# Altium schematic sheet EPS_MPPT_X_OR_MPB.SchDoc: MPPT-X / MPB ORing
size A4; SheetNumber: 12; SheetTotal: 51
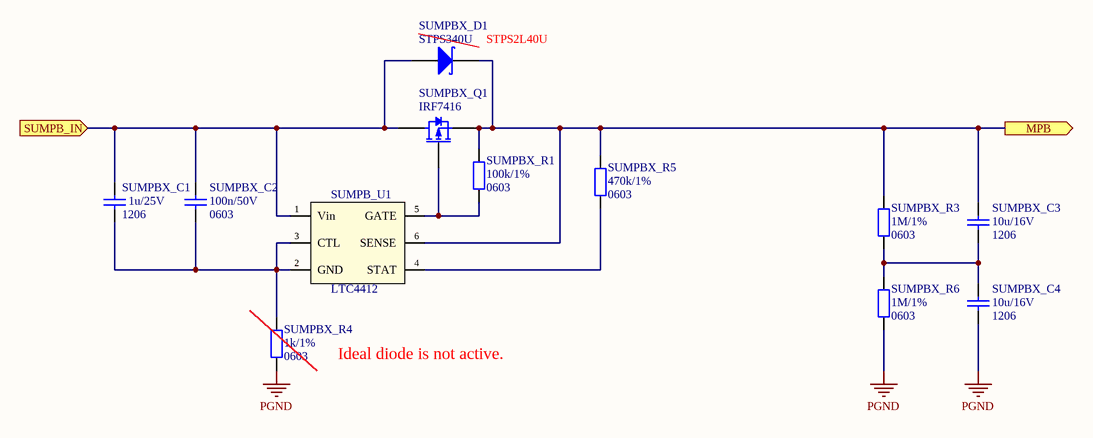
[diagram p0: EPS_MPPT_X_OR_MPB.SchDoc]

## Parts
SUMPB_U1  LTC4412  [SOT23-6]
SUMPBX_C1  Package: 1206  [SMD_Capacitor_1206]  (hidden comment: 1u/25V)
SUMPBX_C2  Package: 0603  [SMD_Capacitor_0603]  (hidden comment: 100n/50V)
SUMPBX_C3  Packge: 1206  [SMD_Capacitor_1206]  (hidden comment: 10u/16V)
SUMPBX_C4  Packge: 1206  [SMD_Capacitor_1206]  (hidden comment: 10u/16V)
SUMPBX_D1  STPS340U  [DO-214AA]
SUMPBX_Q1  IRF7416  [SOIC-8-N_SSSGDDDD]
SUMPBX_R1  Package: 0603  [SMD_Resistor_0603]  (hidden comment: 100k/1%)
SUMPBX_R3  Package: 0603  [SMD_Resistor_0603]  (hidden comment: 1M/1%)
SUMPBX_R4  Package: 0603  [SMD_Resistor_0603]  (hidden comment: 1k/1%)
SUMPBX_R5  Package: 0603  [SMD_Resistor_0603]  (hidden comment: 470k/1%)
SUMPBX_R6  Package: 0603  [SMD_Resistor_0603]  (hidden comment: 1M/1%)

## Ports
MPB (out), SUMPB_IN (in)

## Nets
PGND: SUMPBX_C4.2 SUMPBX_R4.2 SUMPBX_R6.2
MPB: SUMPB_U1.6(SENSE) SUMPBX_C3.1 SUMPBX_D1.K SUMPBX_Q1.S SUMPBX_R1.1 SUMPBX_R3.1 SUMPBX_R5.1 ; port MPB
SUMPB_IN: SUMPB_U1.1(Vin) SUMPBX_C1.1 SUMPBX_C2.1 SUMPBX_D1.A SUMPBX_Q1.D ; port SUMPB_IN
NetSUMPB_U1_2: SUMPB_U1.2(GND) SUMPB_U1.3(CTL) SUMPBX_C1.2 SUMPBX_C2.2 SUMPBX_R4.1
NetSUMPB_U1_4: SUMPB_U1.4(STAT) SUMPBX_R5.2
NetSUMPB_U1_5: SUMPB_U1.5(GATE) SUMPBX_Q1.G SUMPBX_R1.2
NetSUMPBX_C3_2: SUMPBX_C3.2 SUMPBX_C4.1 SUMPBX_R3.2 SUMPBX_R6.1

## Notes on the sheet
- (near SUMPBX_D1) STPS2L40U
- Ideal diode is not active.
- Title:
- Project:
- Author:
- Model:
- Document Number:
- Checked by:
- Rev:
- Date:
- Approved by:
- Sheet:
- of
- File name:

## Library data of the parts
SUMPB_U1 = LTC4412: Ideal Diode, Low Loss PowerPath Controller.; Manufacturer: Linear Technology; Value: LTC4412
SUMPBX_C1 = Cer_C1206T105K3RALTU: Ceramic Cap Kemet COTS 1u/25V X7R 1206; ManufacturerPartNumber: C1206T105K3RALTU; Manufacturer: Kemet; Value: 1u/25V
SUMPBX_C2 = Cer_GCJ188R71H104KA12D: Ceramic Cap Murata Automotive 100n/50V X7R 0603; Manufacturer: Murata; ManufacturerPartNumber: GCJ188R71H104KA12D; Value: 100n/50V
SUMPBX_C3 SUMPBX_C4 = Cer_C1206T106K4RACTU: Ceramic Cap Kemet COTS 10u/16V X7R 1206; ManufacturerPartNumber: C1206T106K4RACTU; Manufacturer: Kemet; Value: 10u/16V
SUMPBX_D1 = STPS340x: 3A/40V Power Schottky Rectifier.; Manufacturer: STMicroelectronics; Value: STPS340U
SUMPBX_Q1 = IRF7416: 10A/30V HEXFET Power P-MOSFET.; Manufacturer: International Rectifier; Value: IRF7416
SUMPBX_R1 SUMPBX_R3-SUMPBX_R6 = Res
  SUMPBX_R1: Value: 100k/1%
  SUMPBX_R3 SUMPBX_R6: Value: 1M/1%
  SUMPBX_R4: Value: 1k/1%
  SUMPBX_R5: Value: 470k/1%